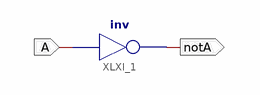
[diagram p0: schematic sheet 1]
// Xilinx ISE schematic sch.sch (virtex5) as structural Verilog: 1 symbols, 2 ports
module sch (
  input  A,
  output notA
);

  not XLXI_1 (notA, A);
endmodule
